# Altium schematic sheet PWR_FG.SchDoc
size A4; SheetNumber: 7; SheetTotal: 6; DrawingNumber: SCH-001; SheetSize: A4
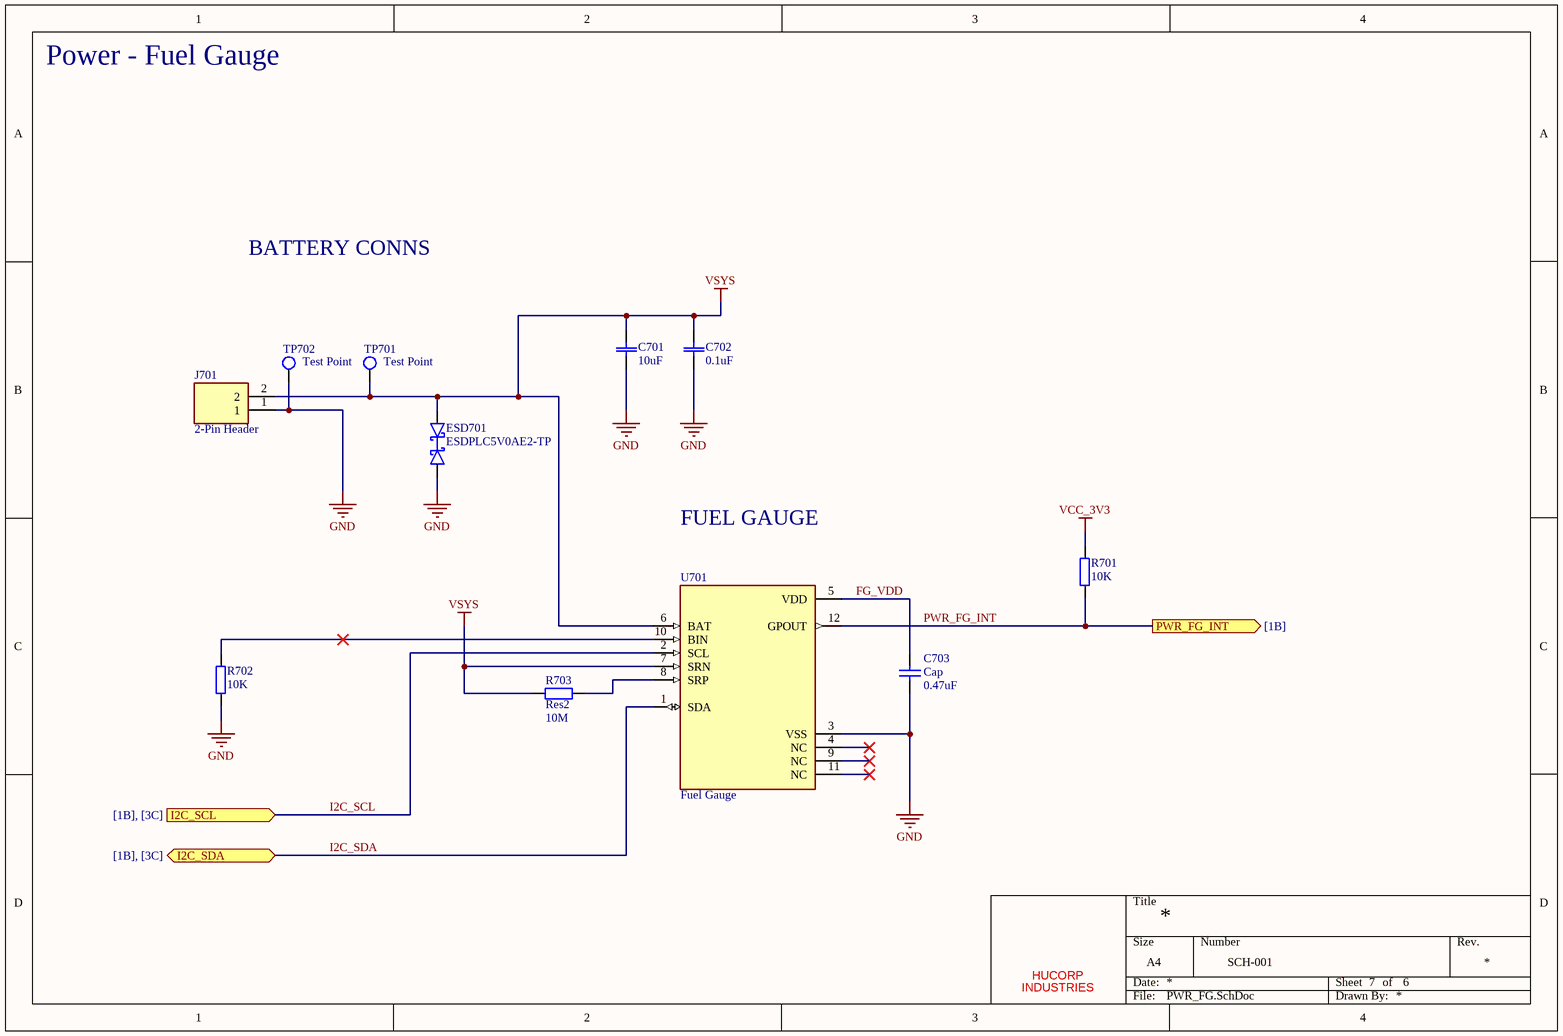
[diagram p0: PWR_FG.SchDoc]

## Parts
*  HUCORP  (value not drawn)  (graphical)
C701  value 10uF  [CAP_CL10_SAM]  (hidden comment: 10 uF)
C702  value 0.1uF  [CAP_CL10_SAM]  (hidden comment: 100 nF)
C703  Cap  value 0.47uF  [RAD-0.3]
ESD701  ESDPLC5V0AE2-TP  [ESDPLC5V0AE2]
J701  2-Pin Header  [TE_2-644861-2]
R701  10K  [RES_RC0603_YAG]
R702  10K  [RES_RC0603_YAG]
R703  Res2  value 10M  [AXIAL-0.4]
TP701  Test Point  [TestPoint1]  (no BOM)
TP702  Test Point  [TestPoint1]  (no BOM)
U701  Fuel Gauge  [IC_BQ27441DRZR-G1A]

## Ports
I2C_SCL (in, see [1B], [3C]), I2C_SDA (bidir, see [1B], [3C]), PWR_FG_INT (out, see [1B])

## Nets
GND: C701.1 C702.1 C703.1 ESD701.2 J701.1 R702.1 TP702.1 U701.3(VSS)
VCC_3V3: R701.2
VSYS: C701.2 C702.2 ESD701.1 J701.2 R703.2 TP701.1 U701.6(BAT) U701.7(SRN)
FG_VDD: C703.2 U701.5(VDD)
I2C_SCL: U701.2(SCL) ; port I2C_SCL
I2C_SDA: U701.1(SDA) ; port I2C_SDA
PWR_FG_INT: R701.1 U701.12(GPOUT) ; port PWR_FG_INT
NetR702_2: R702.2 U701.10(BIN)
NetR703_1: R703.1 U701.8(SRP)

Not connected (* = marked no-connect by the designer): U701 4(NC)* 9(NC)* 11(NC)*

## Notes on the sheet
- Power - Fuel Gauge
- BATTERY CONNS
- FUEL GAUGE
- (in symbol TitleBlock1) Title; Size; Number; Rev.; INDUSTRIES; Date:; Sheet; of; File:; Drawn By:

## Library data of the parts
* = TitleBlock1: HUCORP Title Block
C701 = CL10A106MQ8NNNC: 10 µF ±20% 6.3V Ceramic Capacitor X5R 0603 (1608 Metric); Mfr_Name: Samsung; Type: DEV; Copyright: Copyright (C) 2022 Ultra Librarian. All rights reserved.; Manufacturer_Part_Number: CL10A106MQ8NNNC; Digi-Key_Part_Number_1: 1276-1119-2-ND; Digi-Key_Part_Number_2: 1276-1119-1-ND; Digi-Key_Part_Number_3: 1276-1119-6-ND; RefDes: RefDes
C702 = CL10B104KA8NNNC: CAP CER 0.1UF 25V X7R 0603; Mfr_Name: Samsung; Type: DEV; Copyright: Copyright (C) 2022 Ultra Librarian. All rights reserved.; Manufacturer_Part_Number: CL10B104KA8NNNC; Digi-Key_Part_Number_1: 1276-1006-2-ND; Digi-Key_Part_Number_2: 1276-1006-1-ND; Digi-Key_Part_Number_3: 1276-1006-6-ND; RefDes: RefDes
C703 = Cap: Capacitor; Published: 8-Jun-2000; LatestRevisionDate: 17-Jul-2002; LatestRevisionNote: Re-released for DXP Platform.; PackageReference: RAD-0.3; Publisher: Altium Limited; PackageDescription: Radial Cap, Thru-Hole; 2 Leads; 0.3 in Pin Spacing
ESD701 = ESDPLC5V0AE2-TP: TVS DIODE 5.5VWM 15VC 0201-A
J701 = 2-644861-2: 02P MTA100 SHRD HDR,W/O PEG SN; Number_of_Positions: 2; Centerline_Pitch: 2.54 mm[.1 in]; Product_Type: Connector; MF: TE Connectivity; Value: *; SnapEDA_Link: https://www.snapeda.com/parts/2-644861-2/TE+Connectivity+AMP+Connectors/view-part/?ref=snap; MP: 2-644861-2; Package: None; Check_prices: https://www.snapeda.com/parts/2-644861-2/TE+Connectivity+AMP+Connectors/view-part/?ref=eda; Digi-Key_Part_Number: A30931-ND; Purchase-URL: https://pricing.snapeda.com/search/part/2-644861-2/?ref=eda
R701 R702 = RC0603JR-1310KL: RES 10K OHM 5% 1/10W 0603; Mfr_Name: Yageo; Copyright: Copyright (C) 2022 Ultra Librarian. All rights reserved.; Manufacturer_Part_Number: RC0603JR-1310KL; Digi-Key_Part_Number_1: 13-RC0603JR-1310KLTR-ND; Digi-Key_Part_Number_2: 13-RC0603JR-1310KLCT-ND; Digi-Key_Part_Number_3: 13-RC0603JR-1310KLDKR-ND; RefDes: RefDes; Type: DEV; Value: 10K
R703 = Res2: Resistor; Published: 8-Jun-2000; LatestRevisionDate: 17-Jul-2002; LatestRevisionNote: Re-released for DXP Platform.; PackageReference: AXIAL-0.4; Publisher: Altium Limited; PackageDescription: Axial Device, Thru-Hole; 2 Leads; 0.4 in Pin Spacing
TP701 TP702 = TestPoint1: General Test Point
U701 = BQ27441DRZR-G1A: System-side Impedance Track battery fuel (gas) gauge 12-SON -40 to 85; MF: Texas Instruments; Value: *; SnapEDA_Link: https://www.snapeda.com/parts/BQ27441DRZR-G1A/Texas%20Instruments/view-part/331244/?ref=snap; MP: BQ27441DRZR-G1A; Package: VSON-12 Texas Instruments; Check_prices: https://www.snapeda.com/parts/BQ27441DRZR-G1A/Texas%20Instruments/view-part/331244/?ref=eda; Digi-Key_Part_Number: 296-39941-1-ND; Purchase-URL: https://pricing.snapeda.com/search/part/BQ27441DRZR-G1A/?ref=eda